# Altium project ASK.PrjPcb
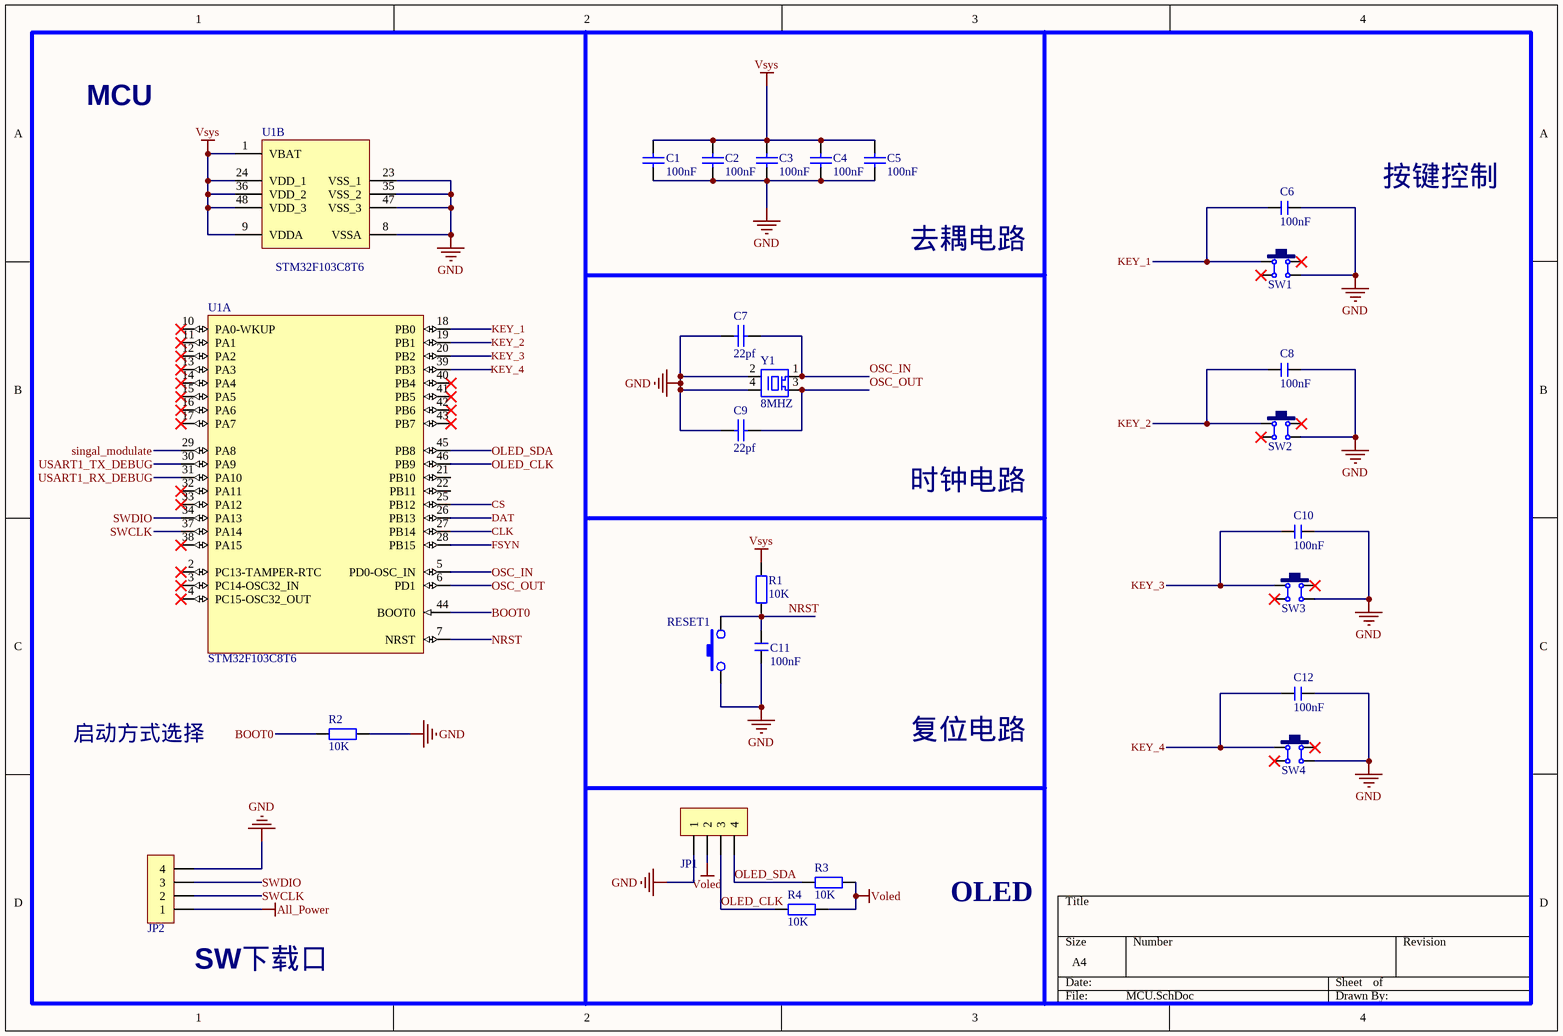
[diagram p0: MCU.SchDoc]
4 sheets, 106 parts. Net scope: global (net labels, ports and power ports of the same name join across sheets).
Board file: ASK_PCB.PcbDoc
Sheets:
  MCU.SchDoc
  OUT.SchDoc
  USART.SchDoc
  POWER.SchDoc

## Sheet MCU.SchDoc
size A4; SheetNumber: 1; SheetTotal: 4

### Parts
C1  100nF  [C0603_M]
C2  100nF  [C0603_M]
C3  100nF  [C0603_M]
C4  100nF  [C0603_M]
C5  100nF  [C0603_M]
C6  100nF  [C0603_M]
C7  22pf  [C0603_M]
C8  100nF  [C0603_M]
C9  22pf  [C0603_M]
C10  100nF  [C0603_M]
C11  100nF  [C0603_M]
C12  100nF  [C0603_M]
JP1  HDR-1X4  [HDR2.54-M-LI-4P]  (value not drawn)
JP2  HDR-1X4  [HDR2.54-WI-4P]  (value not drawn)
R1  10K  [R0603_M]
R2  10K  [R0603_M]
R3  10K  [R0603_M]
R4  10K  [R0603_M]
RESET1  KEY  [SW SMD-3*6*4.3]  (value not drawn)
SW1  12x12x5  [SW SMD-6*6*5]  (value not drawn)
SW2  12x12x5  [SW SMD-6*6*5]  (value not drawn)
SW3  12x12x5  [SW SMD-6*6*5]  (value not drawn)
SW4  12x12x5  [SW SMD-6*6*5]  (value not drawn)
U1  STM32F103C8T6  [LQFP48_N]  (parts A,B of 2)
Y1  8MHZ  [OSC 3225-4P]

### Nets
All_Power: JP2.1
GND: C1.1 C2.1 C3.1 C4.1 C5.1 C6.2 C7.1 C8.2 C9.1 C10.2 C11.2 C12.2 JP1.1 JP2.4 R2.2 RESET1.1 SW1.3 SW2.3 SW3.3 SW4.3 U1.8(VSSA) U1.23(VSS_1) U1.35(VSS_2) U1.47(VSS_3) Y1.2(GND) Y1.4(GND)
Voled: JP1.2 R3.2 R4.2
Vsys: C1.2 C2.2 C3.2 C4.2 C5.2 R1.2 U1.1(VBAT) U1.9(VDDA) U1.24(VDD_1) U1.36(VDD_2) U1.48(VDD_3)
BOOT0: R2.1 U1.44(BOOT0)
CLK: U1.27(PB14)
CS: U1.25(PB12)
DAT: U1.26(PB13)
FSYN: U1.28(PB15)
KEY_1: C6.1 SW1.1 U1.18(PB0)
KEY_2: C8.1 SW2.1 U1.19(PB1)
KEY_3: C10.1 SW3.1 U1.20(PB2)
KEY_4: C12.1 SW4.1 U1.39(PB3)
NRST: C11.1 R1.1 RESET1.2 U1.7(NRST)
OLED_CLK: JP1.3 R4.1 U1.46(PB9)
OLED_SDA: JP1.4 R3.1 U1.45(PB8)
OSC_IN: C7.2 U1.5(PD0-OSC_IN) Y1.1(XTAL1)
OSC_OUT: C9.2 U1.6(PD1) Y1.3(XTAL3)
singal_modulate: U1.29(PA8)
SWCLK: JP2.2 U1.37(PA14)
SWDIO: JP2.3 U1.34(PA13)
USART1_RX_DEBUG: U1.31(PA10)
USART1_TX_DEBUG: U1.30(PA9)

Not connected (* = marked no-connect by the designer): SW1 2* 4*; SW2 2* 4*; SW3 2* 4*; SW4 2* 4*; U1 2(PC13-TAMPER-RTC)* 3(PC14-OSC32_IN)* 4(PC15-OSC32_OUT)* 10(PA0-WKUP)* 11(PA1)* 12(PA2)* 13(PA3)* 14(PA4)* 15(PA5)* 16(PA6)* 17(PA7)* 21(PB10) 22(PB11) 32(PA11)* 33(PA12)* 38(PA15)* 40(PB4)* 41(PB5)* 42(PB6)* 43(PB7)*

### Notes on the sheet
- MCU
- 按键控制
- 去耦电路
- 时钟电路
- 启动方式选择
- 复位电路
- OLED
- (near JP2) SW下载口

### Library data of the parts
C1-C5 = C: 贴片电容/MLCC电容; BOM名称: 无极性贴片电容; 当前库版本V2022.11.14 @淘宝卖家:黄晶宝石: 最新版本发布https://shop463601444.taobao.com
C6 C8 C10 C12 = C: 贴片电容; BOM名称: 无极性贴片电容; 淘宝ID: 封装库来自淘宝 ID：黄晶宝石; 联系售后，技术支持: https://shop463601444.taobao.com; 唯一出售店铺网址: https://shop463601444.taobao.com
C7 C9 = C: 贴片电容; BOM名称: 无极性贴片电容; 联系卖家，免费查找封装: 唯一出售店铺网址https://shop463601444.taobao.com
C11 = C: 无极性贴片电容; 版权归属: 源创客; BOM名称: 无极性贴片电容; 学习资源: www.ooocke.com
JP1 JP2 = Header 4: 4P接插件; 封装库来自淘宝卖家 ID：黄晶宝石: 其他店铺购入均为盗版假冒封装库; 联系卖家，免费查找封装: 唯一出售店铺网址https://shop463601444.taobao.com; BOM名称: 4P接插件
R1 = R: 贴片电阻; 版权归属: 源创客; BOM名称: 贴片电阻; 学习资源: www.ooocke.com
R2 = R: 贴片电阻; 联系卖家，免费查找封装: 唯一出售店铺网址https://shop463601444.taobao.com; BOM名称: 贴片电阻
R3 R4 = R_1: 贴片电阻; 联系卖家，免费查找封装: 唯一出售店铺网址https://shop463601444.taobao.com; BOM名称: 贴片电阻
SW1-SW4 = TSW SMD-12x12: 贴片12x12轻触开关; 版权归属: 封装库来自淘宝 ID：黄晶宝石; BOM名称: 贴片12x12轻触开关; 唯一出售店铺网址: https://shop463601444.taobao.com
U1 = STM32F103C8T6: STM32 ARM-based 32-bit MCU Performance Line with 64 kB Flash, 20 kB Internal RAM, -40 to +85癈 Temperature, 48-Pin LQFP, Tray; DatasheetVersion: rev13.0, Apr-2011; PackageVersion: rev13, Apr-2011; PackageReference: LQFP48; PackageDescription: 48-Pin Low-Profile Quad Flat Pack, 7 x 7 mm Body, 0.5 mm Pitch (LQFP48); ComponentLink1Description: Manufacturer URL; ComponentLink1URL: http://www.st.com/; ComponentLink2Description: STM32F103 Datasheet; ComponentLink2URL: http://www.st.com/internet/com/TECHNICAL_RESOURCES/TECHNICAL_LITERATURE/DATASHEET/CD00161566.pdf; ComponentLink3Description: STM32 Family Web Page; ComponentLink3URL: www.st.com/stm32; 联系售后: https://shop463601444.taobao.com
Y1 = jinzheng

## Sheet OUT.SchDoc
size A4; SheetNumber: 2; SheetTotal: 4
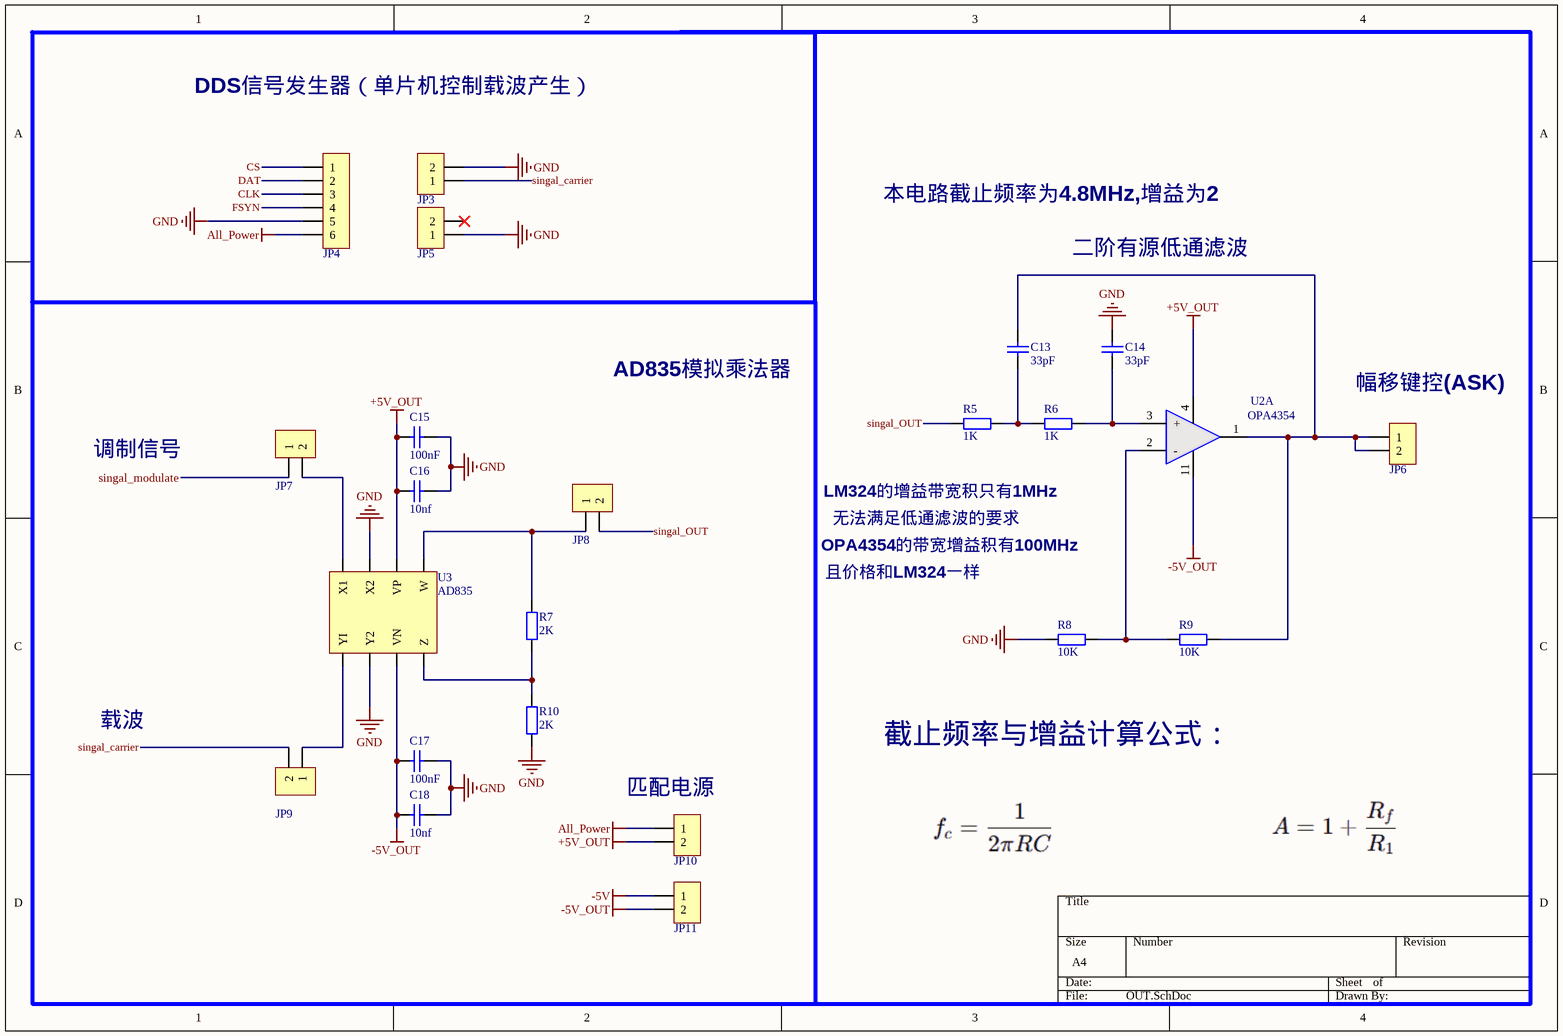
[diagram p1: OUT.SchDoc]

### Parts
C13  33pF  [C0603_M]
C14  33pF  [C0603_M]
C15  100nF  [C0603_M]
C16  10nf  [C0603_M]
C17  100nF  [C0603_M]
C18  10nf  [C0603_M]
JP3  HDR-1X2  [HDR2.54-M-LI-2P]  (value not drawn)
JP4  HDR-1X6  [HDR2.54-M-LI-6P]  (value not drawn)
JP5  HDR-1X2  [HDR2.54-M-LI-2P]  (value not drawn)
JP6  HDR-1X2  [HDR2.54-LI-2P]  (value not drawn)
JP7  HDR-1X2  [HDR2.54-LI-2P]  (value not drawn)
JP8  HDR-1X2  [HDR2.54-LI-2P]  (value not drawn)
JP9  HDR-1X2  [HDR2.54-LI-2P]  (value not drawn)
JP10  HDR-1X2  [HDR2.54-LI-2P]  (value not drawn)
JP11  HDR-1X2  [HDR2.54-LI-2P]  (value not drawn)
R5  1K  [R0603_M]
R6  1K  [R0603_M]
R7  2K  [R0603_M]
R8  10K  [R0603_M]
R9  10K  [R0603_M]
R10  2K  [R0603_M]
U2  OPA4354  [SOP14_M]  (part A of 4)
U3  AD835  [SOP8_L]

### Nets
+5V_OUT: C15.1 C16.2 JP10.2 U2.4(V+) U3.6(VP)
-5V: JP11.1
-5V_OUT: C17.1 C18.2 JP11.2 U2.11(V-) U3.3(VN)
All_Power: JP4.6 JP10.1
GND: C14.2 C15.2 C16.1 C17.2 C18.1 JP3.2 JP4.5 JP5.1 R8.2 R10.1 U3.2(Y2) U3.7(X2)
CLK: JP4.3
CS: JP4.1
DAT: JP4.2
FSYN: JP4.4
singal_carrier: JP3.1 JP9.2
singal_modulate: JP7.1
singal_OUT: JP8.2 R5.1
NetC13_1: C13.1 R5.2 R6.1
NetC13_2: C13.2 JP6.1 JP6.2 R9.2 U2.1(OUT)
NetC14_1: C14.1 R6.2 U2.3(+)
NetJP7_2: JP7.2 U3.8(X1)
NetJP8_1: JP8.1 R7.1 U3.5(W)
NetJP9_1: JP9.1 U3.1(YI)
NetR7_2: R7.2 R10.2 U3.4(Z)
NetR8_1: R8.1 R9.1 U2.2(-)

Not connected (* = marked no-connect by the designer): JP5 2*

### Notes on the sheet
- DDS信号发生器（单片机控制载波产生）
- 本电路截止频率为4.8MHz,增益为2
- 二阶有源低通滤波
- AD835模拟乘法器
- (near JP6) 幅移键控(ASK)
- 调制信号
- 无法满足低通滤波的要求
- LM324的增益带宽积只有1MHz
- 且价格和LM324一样
- OPA4354的带宽增益积有100MHz
- 载波
- 截止频率与增益计算公式：
- (near JP10) 匹配电源

### Library data of the parts
C13-C15 C17 = C: as C1 on sheet MCU
C16 C18 = C_3: 贴片电容; BOM名称: 无极性贴片电容; 联系卖家，免费查找封装: 唯一出售店铺网址https://shop463601444.taobao.com
JP3 JP5-JP9 = Header 2: 2P接插件; 版权归属: 封装库来自淘宝 ID：黄晶宝石; BOM名称: 2P接插件
JP4 = Header 6: 6P接插件; 学习资源: 最新版本发布https://item.taobao.com/item.htm?id=566775463719; 版权归属: 封装库来自淘宝 ID：黄晶宝石; BOM名称: 6P接插件
JP10 JP11 = Header 2: 2P接插件; 联系卖家，免费查找封装: 唯一出售店铺网址https://shop463601444.taobao.com; 封装库来自淘宝卖家ID：黄晶宝石: 其他店铺购入均为盗版封装库，请立即申请退款，本店现金奖励50~200元; BOM名称: 2P接插件
R5-R10 = R: 贴片电阻; 联系下单店铺卖家 免费帮你查找封装: 联系下单店铺卖家 免费技术支持; BOM名称: 贴片电阻
U2 = LM324: 4运放
U3 = AD835ARZ: 四象限模拟乘法器

## Sheet USART.SchDoc
size A4; SheetNumber: 3; SheetTotal: 4
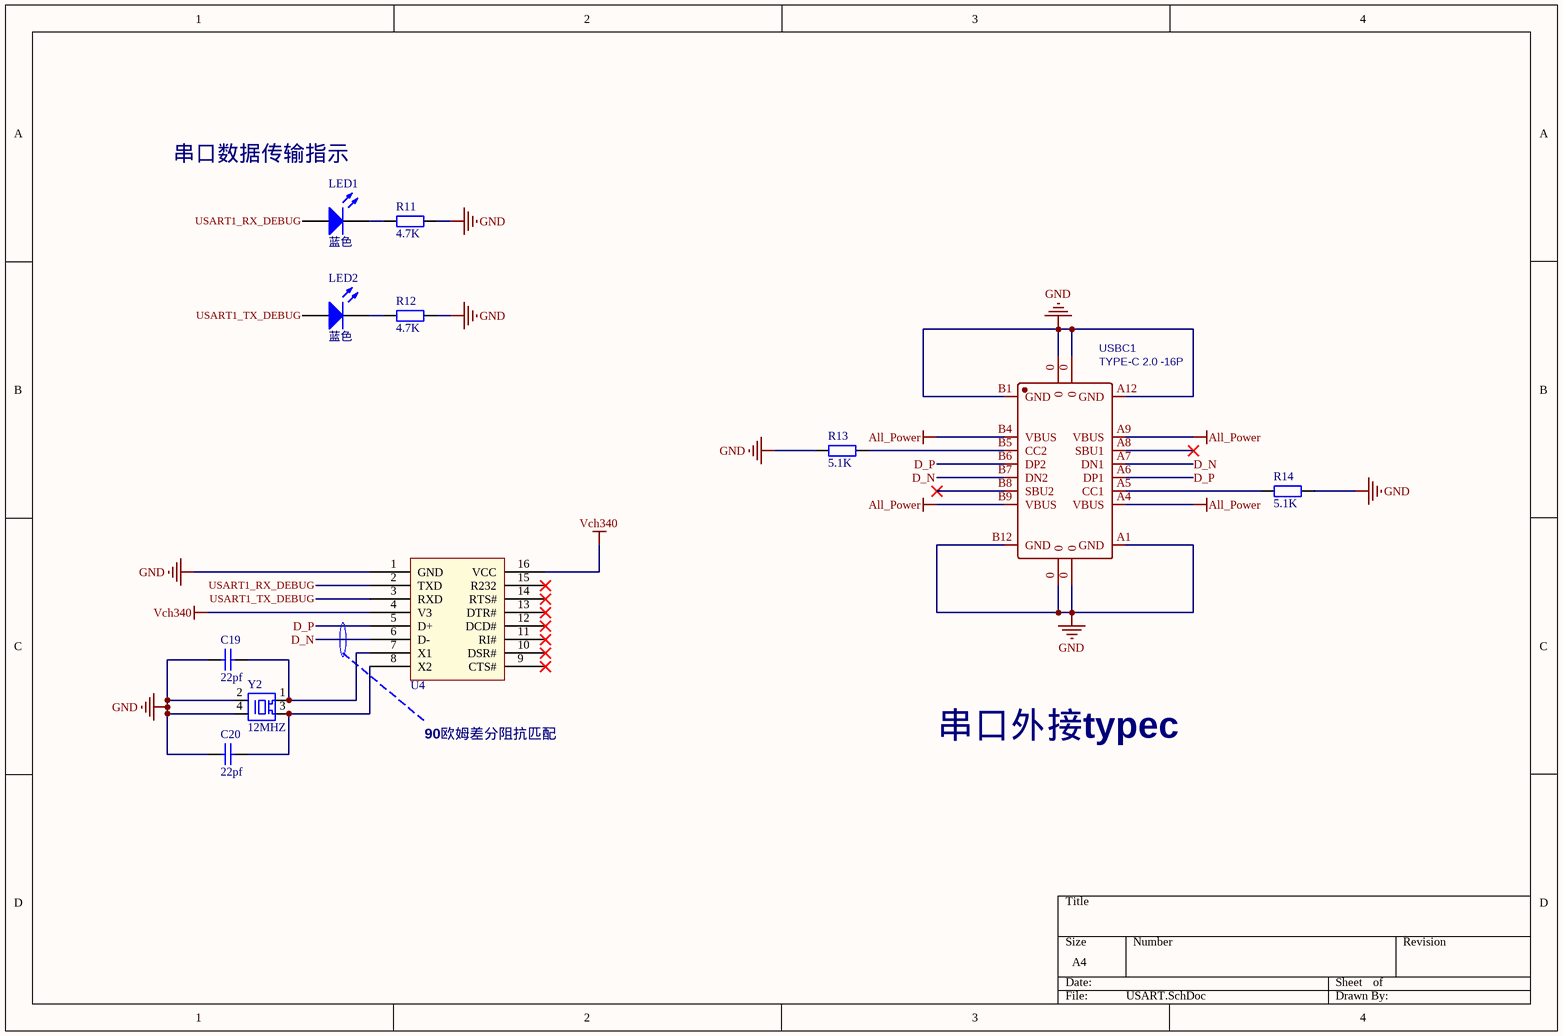
[diagram p2: USART.SchDoc]

### Parts
C19  22pf  [C0603_M]
C20  22pf  [C0603_M]
LED1  蓝色  [LED0603_B]
LED2  蓝色  [LED0603_B]
R11  4.7K  [R0603_M]
R12  4.7K  [R0603_M]
R13  5.1K  [R0603_M]
R14  5.1K  [R0603_M]
U4  CH340G  [SOP16N_N]  (value not drawn)
USBC1  TYPE-C 2.0 -16P  [USB-C-SMD_TYPE-C-USB-5]
Y2  12MHZ  [OSC 3225-4P]

### Nets
All_Power: USBC1.A4(VBUS) USBC1.A9(VBUS) USBC1.B4(VBUS) USBC1.B9(VBUS)
GND: C19.1 C20.1 R11.1 R12.1 R13.1 R14.1 U4.1(GND) USBC1.0 USBC1.A1(GND) USBC1.A12(GND) USBC1.B1(GND) USBC1.B12(GND) Y2.2(GND) Y2.4(GND)
Vch340: U4.4(V3) U4.16(VCC)
D_N: U4.6(D-) USBC1.A7(DN1) USBC1.B7(DN2)
D_P: U4.5(D+) USBC1.A6(DP1) USBC1.B6(DP2)
USART1_RX_DEBUG: LED1.1(A) U4.2(TXD)
USART1_TX_DEBUG: LED2.1(A) U4.3(RXD)
NetC19_2: C19.2 U4.7(X1) Y2.1(XTAL1)
NetC20_2: C20.2 U4.8(X2) Y2.3(XTAL3)
NetLED1_2: LED1.2(K) R11.2
NetLED2_2: LED2.2(K) R12.2
NetR13_2: R13.2 USBC1.B5(CC2)
NetR14_2: R14.2 USBC1.A5(CC1)

Not connected (* = marked no-connect by the designer): U4 9(CTS#)* 10(DSR#)* 11(RI#)* 12(DCD#)* 13(DTR#)* 14(RTS#)* 15(R232)*; USBC1 A8(SBU1)* B8(SBU2)*

### Notes on the sheet
- 串口数据传输指示
- 90欧姆差分阻抗匹配
- 串口外接typec

### Library data of the parts
C19 C20 = C: as C7 on sheet MCU
LED1 LED2 = LED: 贴片LED; 封装库来自淘宝卖家：黄晶宝石: 其他店铺购入均为盗版封装库，无更新权益，请立即申请退款，本店现金奖励200~1000元; BOM名称: 贴片LED
R11 R12 = R: as R2 on sheet MCU; BOM名称: 贴片电阻
R13 R14 = R: 贴片电阻; 版权归属: 来自淘宝 ID：黄晶宝石; 封装库来自淘宝卖家 ID：黄晶宝石: 其他店铺购入均为盗版，不享受售后技术支持服务，请立即申请退款; BOM名称: 贴片电阻; 联系售后: https://item.taobao.com/item.htm?id=566775463719
U4 = CH340G: 技术支持，联系售后: 封装库来自淘宝卖家 ID：黄晶宝石; 唯一出售店铺网址: https://shop463601444.taobao.com
USBC1 = USB2.0 Type-C 16Pin母座: USB2.0 Type-C 母座 16Pin; BOM_Supplier: LCSC; BOM_Manufacturer Part: -; spiceSymbolName: TYPE-C 3.1 -16P_C168689
Y2 = jinzheng

## Sheet POWER.SchDoc
size A3; SheetNumber: 4; SheetTotal: 4
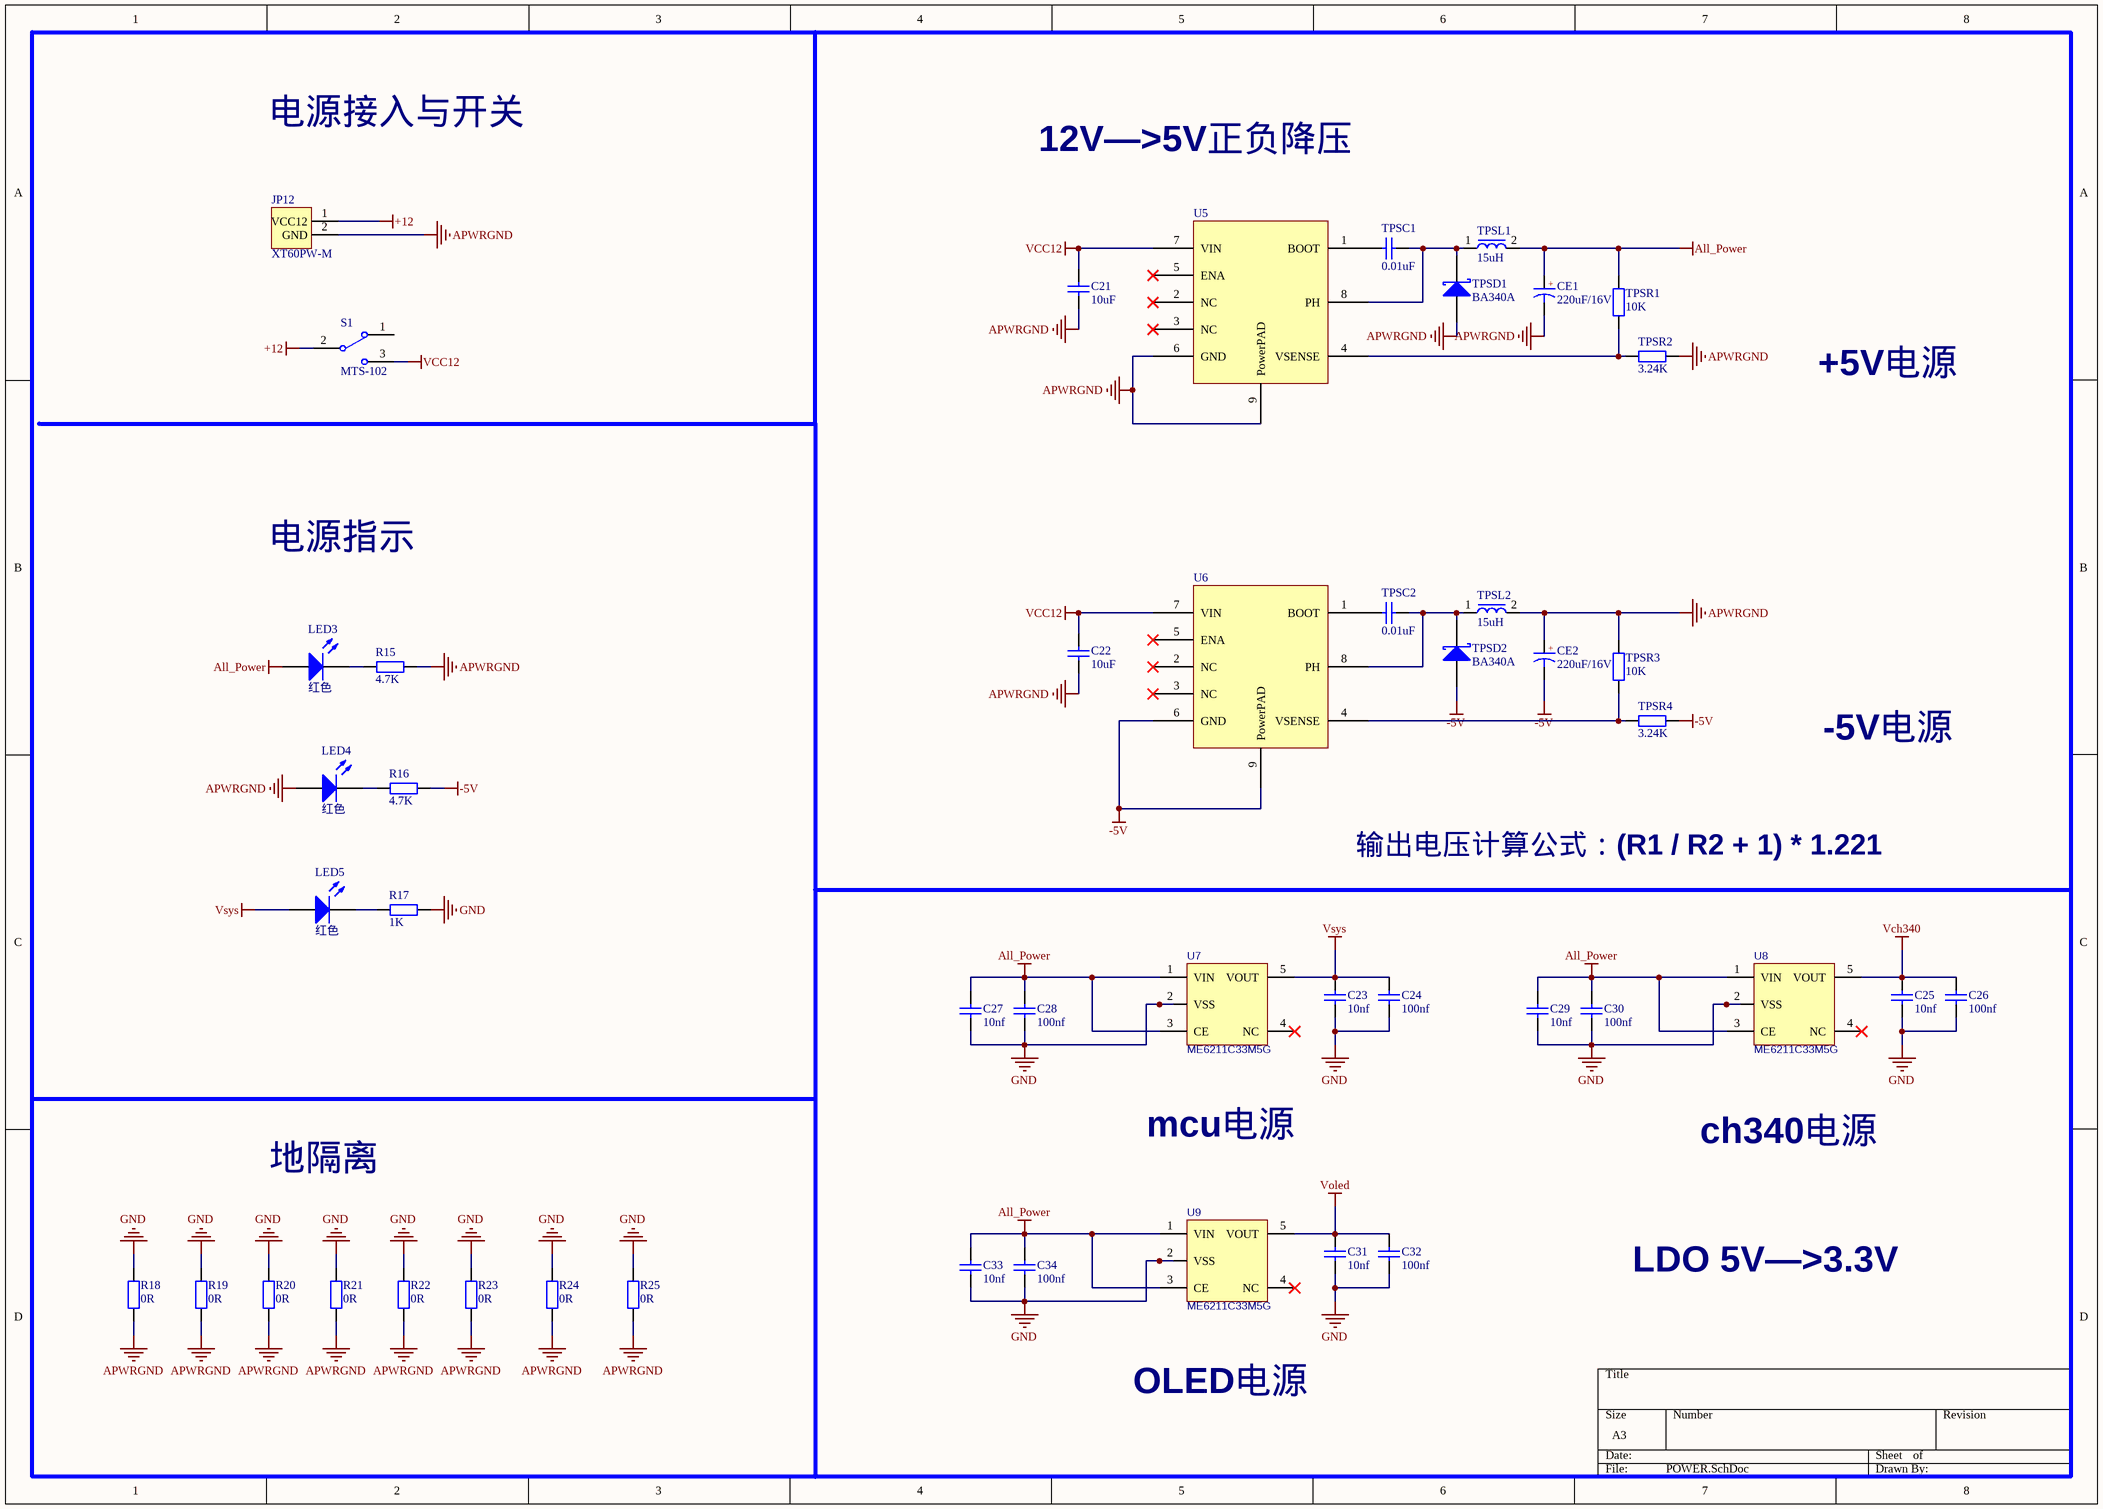
[diagram p3: POWER.SchDoc]

### Parts
C21  10uF  [C0603_M]
C22  10uF  [C0603_M]
C23  10nf  [C0603_M]
C24  100nf  [C0603_M]
C25  10nf  [C0603_M]
C26  100nf  [C0603_M]
C27  10nf  [C0603_M]
C28  100nf  [C0603_M]
C29  10nf  [C0603_M]
C30  100nf  [C0603_M]
C31  10nf  [C0603_M]
C32  100nf  [C0603_M]
C33  10nf  [C0603_M]
C34  100nf  [C0603_M]
CE1  220uF/16V  [CE D(6.3*5.4)]
CE2  220uF/16V  [CE D(6.3*5.4)]
JP12  XT60PW-M  [TX60PW-M20]
LED3  红色  [LED0603_R]
LED4  红色  [LED0603_R]
LED5  红色  [LED0603_R]
R15  4.7K  [R0603_M]
R16  4.7K  [R0603_M]
R17  1K  [R0603_M]
R18  0R  [R0603_M]
R19  0R  [R0603_M]
R20  0R  [R0603_M]
R21  0R  [R0603_M]
R22  0R  [R0603_M]
R23  0R  [R0603_M]
R24  0R  [R0603_M]
R25  0R  [R0603_M]
S1  MTS-102  [MTS-10x]
TPSC1  0.01uF  [C0603_M]
TPSC2  0.01uF  [C0603_M]
TPSD1  BA340A  [SMC]
TPSD2  BA340A  [SMC]
TPSL1  15uH  [CDRH74]
TPSL2  15uH  [CDRH74]
TPSR1  10K  [R0603_M]
TPSR2  3.24K  [R0603_M]
TPSR3  10K  [R0603_M]
TPSR4  3.24K  [R0603_M]
U5  TPS5430DDAR  [SOP8_M]  (value not drawn)
U6  TPS5430DDAR  [SOP8_M]  (value not drawn)
U7  ME6211C33M5G  [SOT23-5N]
U8  ME6211C33M5G  [SOT23-5N]
U9  ME6211C33M5G  [SOT23-5N]

### Nets
+12: JP12.1(VCC12) S1.2
-5V: CE2.2 R16.1 TPSD2.1(A) TPSR4.1 U6.6(GND) U6.9(PowerPAD)
All_Power: C27.2 C28.2 C29.2 C30.2 C33.2 C34.2 CE1.1 LED3.1(A) TPSL1.2 TPSR1.2 U7.1(VIN) U7.3(CE) U8.1(VIN) U8.3(CE) U9.1(VIN) U9.3(CE)
APWRGND: C21.1 C22.1 CE1.2 CE2.1 JP12.2(GND) LED4.1(A) R15.1 R18.2 R19.2 R20.2 R21.2 R22.2 R23.2 R24.2 R25.2 TPSD1.1(A) TPSL2.2 TPSR2.1 TPSR3.2 U5.6(GND) U5.9(PowerPAD)
GND: C23.1 C24.1 C25.1 C26.1 C27.1 C28.1 C29.1 C30.1 C31.1 C32.1 C33.1 C34.1 R17.2 R18.1 R19.1 R20.1 R21.1 R22.1 R23.1 R24.1 R25.1 U7.2(VSS) U8.2(VSS) U9.2(VSS)
VCC12: C21.2 C22.2 S1.3 U5.7(VIN) U6.7(VIN)
Vch340: C25.2 C26.2 U8.5(VOUT)
Voled: C31.2 C32.2 U9.5(VOUT)
Vsys: C23.2 C24.2 LED5.1(A) U7.5(VOUT)
NetLED3_2: LED3.2(K) R15.2
NetLED4_2: LED4.2(K) R16.2
NetLED5_2: LED5.2(K) R17.1
NetTPSC1_1: TPSC1.1 TPSD1.2(K) TPSL1.1 U5.8(PH)
NetTPSC1_2: TPSC1.2 U5.1(BOOT)
NetTPSC2_1: TPSC2.1 TPSD2.2(K) TPSL2.1 U6.8(PH)
NetTPSC2_2: TPSC2.2 U6.1(BOOT)
NetTPSR1_1: TPSR1.1 TPSR2.2 U5.4(VSENSE)
NetTPSR3_1: TPSR3.1 TPSR4.2 U6.4(VSENSE)

Not connected (* = marked no-connect by the designer): S1 1; U5 2(NC)* 3(NC)* 5(ENA)*; U6 2(NC)* 3(NC)* 5(ENA)*; U7 4(NC)*; U8 4(NC)*; U9 4(NC)*

### Notes on the sheet
- 电源接入与开关
- 12V—>5V正负降压
- +5V电源
- 电源指示
- -5V电源
- 输出电压计算公式：(R1 / R2 + 1) * 1.221
- 地隔离
- mcu电源
- ch340电源
- LDO 5V—>3.3V
- OLED电源
- (in symbol CE) +

### Library data of the parts
C21 C22 = C: as C1 on sheet MCU
C23-C34 = C_3: as C16 on sheet OUT
CE1 CE2 = CE: 直插电解电容; 联系卖家，免费查找封装: 唯一出售店铺网址https://shop463601444.taobao.com; BOM名称: 直插电解电容
JP12 = XT60PW: XT60PW-M弯插
LED3-LED5 = LED: as LED1 on sheet USART; BOM名称: 贴片LED
R15-R17 TPSR1-TPSR4 = R: as R2 on sheet MCU; BOM名称: 贴片电阻
R18-R25 = R: 贴片电阻; 联系下单店铺卖家 免费帮你查找封装: 联系下单店铺卖家 免费技术支持; BOM名称: 贴片电阻
S1 = MTS-10x: MTS10x系列3脚扭子开关; 版权归属: 源创客; BOM名称: MTS10x系列3脚扭子开关; 学习资源: www.ooocke.com
TPSC1 TPSC2 = C: as C7 on sheet MCU
TPSD1 TPSD2 = SS210: 肖特基二极管; 联系卖家，免费查找封装: 唯一出售店铺网址https://shop463601444.taobao.com; BOM名称: 肖特基二极管
TPSL1 TPSL2 = L 0630: SMA
U5 U6 = TPS5430DDAR: 输出额定电流3A 纹波30mV
U7-U9 = ME6211C33: LDO 3.3V/0.5A; BOM名称: RT9193-30GB; 当前库版本V2022.11.14 @淘宝卖家:黄晶宝石: 最新版本发布https://shop463601444.taobao.com

## Nets that join several sheets
-5V: OUT (JP11.1), POWER (6 pins)
All_Power: MCU (JP2.1), OUT (JP4.6 JP10.1), USART (USBC1.A4 USBC1.A9 USBC1.B4 USBC1.B9), POWER (16 pins)
GND: MCU (26 pins), OUT (12 pins), USART (14 pins), POWER (24 pins)
Vch340: USART (U4.4 U4.16), POWER (C25.2 C26.2 U8.5)
Voled: MCU (JP1.2 R3.2 R4.2), POWER (C31.2 C32.2 U9.5)
Vsys: MCU (11 pins), POWER (C23.2 C24.2 LED5.1 U7.5)
CLK: MCU (U1.27), OUT (JP4.3)
CS: MCU (U1.25), OUT (JP4.1)
DAT: MCU (U1.26), OUT (JP4.2)
FSYN: MCU (U1.28), OUT (JP4.4)
singal_modulate: MCU (U1.29), OUT (JP7.1)
USART1_RX_DEBUG: MCU (U1.31), USART (LED1.1 U4.2)
USART1_TX_DEBUG: MCU (U1.30), USART (LED2.1 U4.3)